# EAGLE design PointController (EAGLE 6.1)
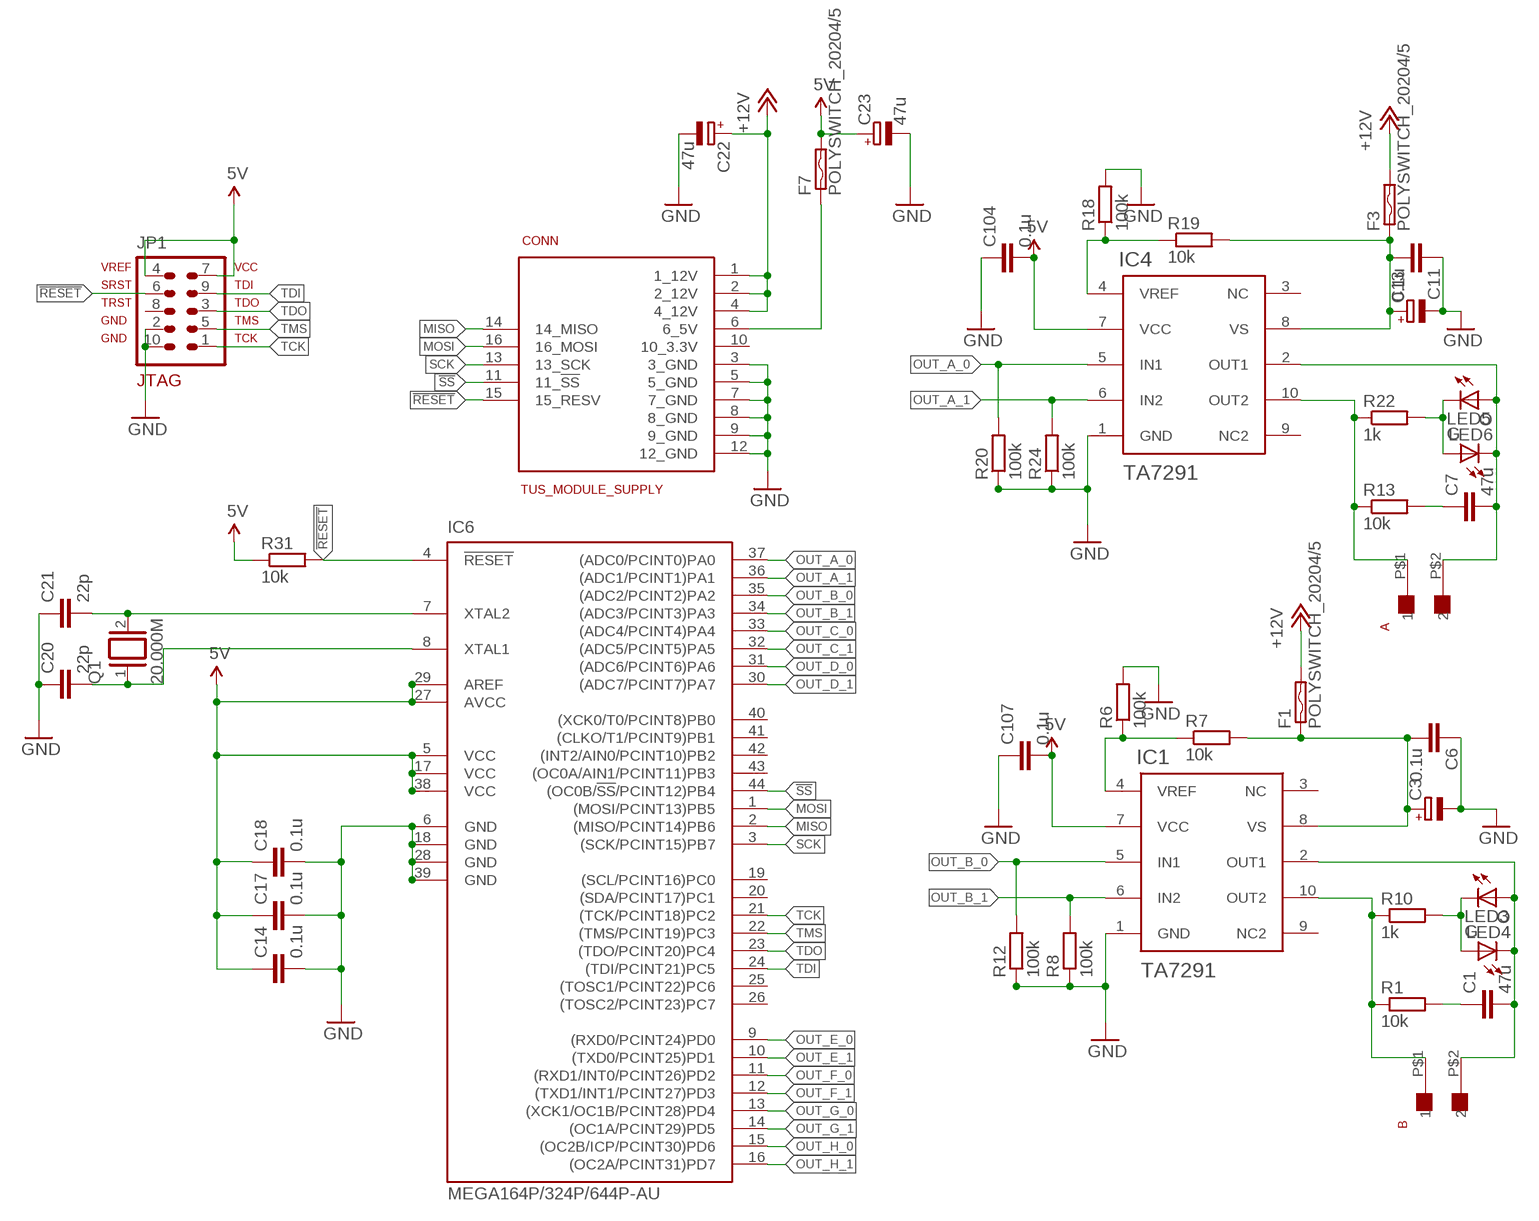
[diagram p0: schematic, sheet 1, part 1 of 2]
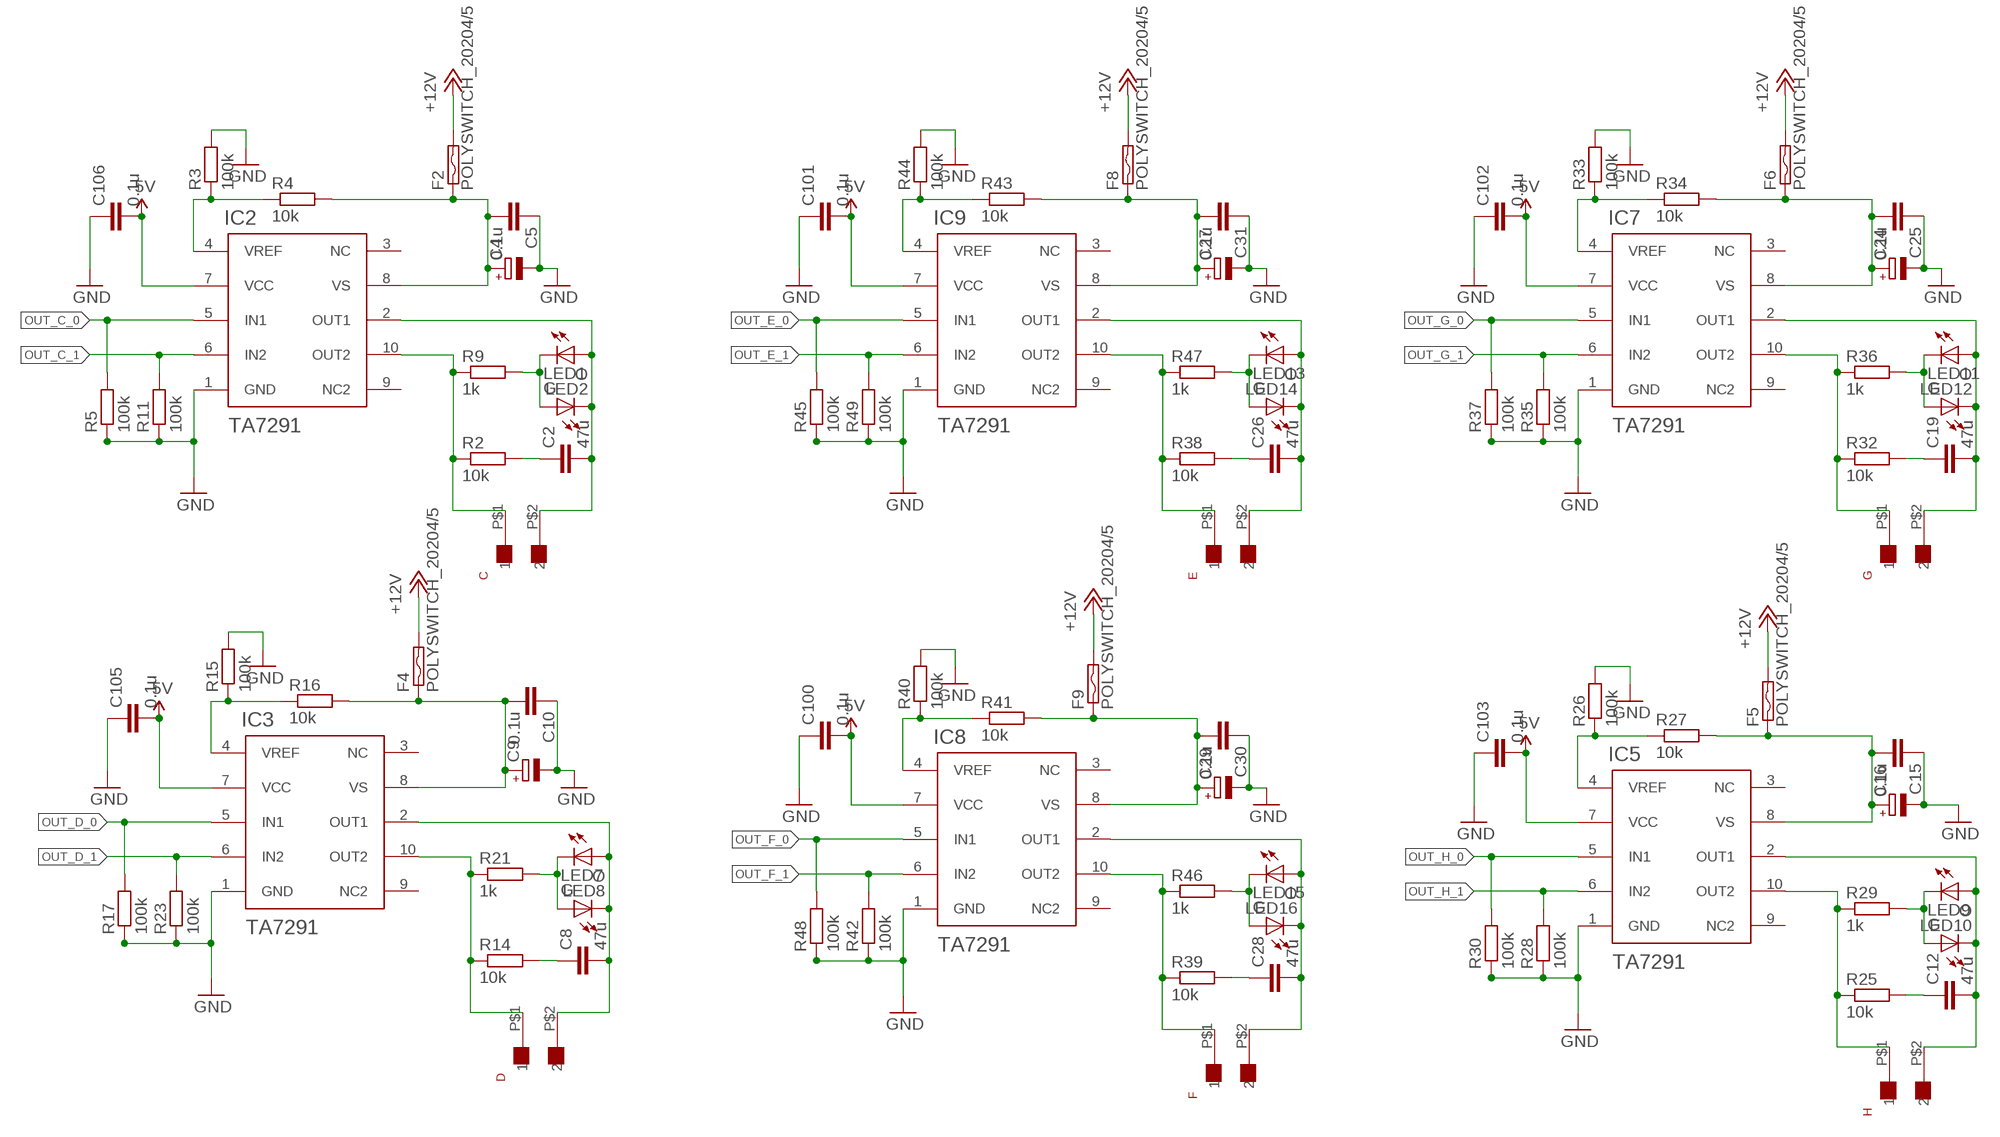
[diagram p1: schematic, sheet 1, part 2 of 2]

## Parts
A  XH-2  [XH-2]
B  XH-2  [XH-2]
C  XH-2  [XH-2]
C1  47u  C5/3  [C5B3]
C2  47u  C5/3  [C5B3]
C3  CPOL-EUE2.5-5  [E2,5-5]
C4  CPOL-EUE2.5-5  [E2,5-5]
C5  0.1u  C-EUC1608  [C1608]
C6  0.1u  C-EUC1608  [C1608]
C7  47u  C5/3  [C5B3]
C8  47u  C5/3  [C5B3]
C9  CPOL-EUE2.5-5  [E2,5-5]
C10  0.1u  C-EUC1608  [C1608]
C11  0.1u  C-EUC1608  [C1608]
C12  47u  C5/3  [C5B3]
C13  CPOL-EUE2.5-5  [E2,5-5]
C14  0.1u  C-EUC1608  [C1608]
C15  0.1u  C-EUC1608  [C1608]
C16  CPOL-EUE2.5-5  [E2,5-5]
C17  0.1u  C-EUC1608  [C1608]
C18  0.1u  C-EUC1608  [C1608]
C19  47u  C5/3  [C5B3]
C20  22p  C-EUC1608  [C1608]
C21  22p  C-EUC1608  [C1608]
C22  47u  CPOL-EUE2.5-5  [E2,5-5]
C23  47u  CPOL-EUE2.5-5  [E2,5-5]
C24  CPOL-EUE2.5-5  [E2,5-5]
C25  0.1u  C-EUC1608  [C1608]
C26  47u  C5/3  [C5B3]
C27  CPOL-EUE2.5-5  [E2,5-5]
C28  47u  C5/3  [C5B3]
C29  CPOL-EUE2.5-5  [E2,5-5]
C30  0.1u  C-EUC1608  [C1608]
C31  0.1u  C-EUC1608  [C1608]
C100  0.1u  C-EUC1608  [C1608]
C101  0.1u  C-EUC1608  [C1608]
C102  0.1u  C-EUC1608  [C1608]
C103  0.1u  C-EUC1608  [C1608]
C104  0.1u  C-EUC1608  [C1608]
C105  0.1u  C-EUC1608  [C1608]
C106  0.1u  C-EUC1608  [C1608]
C107  0.1u  C-EUC1608  [C1608]
CONN  TUS_MODULE_SUPPLY  [2X08]
D  XH-2  [XH-2]
E  XH-2  [XH-2]
F  XH-2  [XH-2]
F1  POLYSWITCH_20204/5  [0204/5]
F2  POLYSWITCH_20204/5  [0204/5]
F3  POLYSWITCH_20204/5  [0204/5]
F4  POLYSWITCH_20204/5  [0204/5]
F5  POLYSWITCH_20204/5  [0204/5]
F6  POLYSWITCH_20204/5  [0204/5]
F7  POLYSWITCH_20204/5  [0204/5]
F8  POLYSWITCH_20204/5  [0204/5]
F9  POLYSWITCH_20204/5  [0204/5]
G  XH-2  [XH-2]
H  XH-2  [XH-2]
IC1  TA7291  [HSIP10]
IC2  TA7291  [HSIP10]
IC3  TA7291  [HSIP10]
IC4  TA7291  [HSIP10]
IC5  TA7291  [HSIP10]
IC6  MEGA164P/324P/644P-AU  [TQFP44]
IC7  TA7291  [HSIP10]
IC8  TA7291  [HSIP10]
IC9  TA7291  [HSIP10]
JP1  AVR-JTAG-10  [AVR-JTAG-10]
LED1  G  LED3MM  [LED3MM]
LED2  O  LED3MM  [LED3MM]
LED3  G  LED3MM  [LED3MM]
LED4  O  LED3MM  [LED3MM]
LED5  G  LED3MM  [LED3MM]
LED6  O  LED3MM  [LED3MM]
LED7  G  LED3MM  [LED3MM]
LED8  O  LED3MM  [LED3MM]
LED9  G  LED3MM  [LED3MM]
LED10  O  LED3MM  [LED3MM]
LED11  G  LED3MM  [LED3MM]
LED12  O  LED3MM  [LED3MM]
LED13  G  LED3MM  [LED3MM]
LED14  O  LED3MM  [LED3MM]
LED15  G  LED3MM  [LED3MM]
LED16  O  LED3MM  [LED3MM]
Q1  20.000M  XTAL/S  [QS]
R1  10k  R-EU_0204/7  [0204/7]
R2  10k  R-EU_0204/7  [0204/7]
R3  100k  R-EU_R0603  [R0603]
R4  10k  R-EU_R0603  [R0603]
R5  100k  R-EU_R0603  [R0603]
R6  100k  R-EU_R0603  [R0603]
R7  10k  R-EU_R0603  [R0603]
R8  100k  R-EU_R0603  [R0603]
R9  1k  R-EU_R0603  [R0603]
R10  1k  R-EU_R0603  [R0603]
R11  100k  R-EU_R0603  [R0603]
R12  100k  R-EU_R0603  [R0603]
R13  10k  R-EU_0204/7  [0204/7]
R14  10k  R-EU_0204/7  [0204/7]
R15  100k  R-EU_R0603  [R0603]
R16  10k  R-EU_R0603  [R0603]
R17  100k  R-EU_R0603  [R0603]
R18  100k  R-EU_R0603  [R0603]
R19  10k  R-EU_R0603  [R0603]
R20  100k  R-EU_R0603  [R0603]
R21  1k  R-EU_R0603  [R0603]
R22  1k  R-EU_R0603  [R0603]
R23  100k  R-EU_R0603  [R0603]
R24  100k  R-EU_R0603  [R0603]
R25  10k  R-EU_0204/7  [0204/7]
R26  100k  R-EU_R0603  [R0603]
R27  10k  R-EU_R0603  [R0603]
R28  100k  R-EU_R0603  [R0603]
R29  1k  R-EU_R0603  [R0603]
R30  100k  R-EU_R0603  [R0603]
R31  10k  R-EU_R0603  [R0603]
R32  10k  R-EU_0204/7  [0204/7]
R33  100k  R-EU_R0603  [R0603]
R34  10k  R-EU_R0603  [R0603]
R35  100k  R-EU_R0603  [R0603]
R36  1k  R-EU_R0603  [R0603]
R37  100k  R-EU_R0603  [R0603]
R38  10k  R-EU_0204/7  [0204/7]
R39  10k  R-EU_0204/7  [0204/7]
R40  100k  R-EU_R0603  [R0603]
R41  10k  R-EU_R0603  [R0603]
R42  100k  R-EU_R0603  [R0603]
R43  10k  R-EU_R0603  [R0603]
R44  100k  R-EU_R0603  [R0603]
R45  100k  R-EU_R0603  [R0603]
R46  1k  R-EU_R0603  [R0603]
R47  1k  R-EU_R0603  [R0603]
R48  100k  R-EU_R0603  [R0603]
R49  100k  R-EU_R0603  [R0603]

## Nets
5V [5v]: C14.1 C17.1 C18.1 C23.+ C100.2 C101.2 C102.2 C103.2 C104.2 C105.2 C106.2 C107.2 F7.2 IC1.7(VCC) IC2.7(VCC) IC3.7(VCC) IC4.7(VCC) IC5.7(VCC) IC6.5(VCC) IC6.17(VCC) IC6.27(AVCC) IC6.29(AREF) IC6.38(VCC) IC7.7(VCC) IC8.7(VCC) IC9.7(VCC) JP1.4 JP1.7 R31.1
!RESET: CONN.15(15_RESV) IC6.4(!RESET) JP1.6 R31.2
!SS: CONN.11(11_!SS) IC6.44((OC0B/!SS!/PCINT12)PB4)
+12V [12v]: C22.+ CONN.1(1_12V) CONN.2(2_12V) CONN.4(4_12V) F1.2 F2.2 F3.2 F4.2 F5.2 F6.2 F8.2 F9.2
GND: C3.- C4.- C5.1 C6.1 C9.- C10.1 C11.1 C13.- C14.2 C15.1 C16.- C17.2 C18.2 C20.1 C21.1 C22.- C23.- C24.- C25.1 C27.- C29.- C30.1 C31.1 C100.1 C101.1 C102.1 C103.1 C104.1 C105.1 C106.1 C107.1 CONN.3(3_GND) CONN.5(5_GND) CONN.7(7_GND) CONN.8(8_GND) CONN.9(9_GND) CONN.12(12_GND) IC1.1(GND) IC2.1(GND) IC3.1(GND) IC4.1(GND) IC5.1(GND) IC6.6(GND) IC6.18(GND) IC6.28(GND) IC6.39(GND) IC7.1(GND) IC8.1(GND) IC9.1(GND) JP1.2 JP1.10 R3.2 R5.1 R6.2 R8.1 R11.1 R12.1 R15.2 R17.1 R18.2 R20.1 R23.1 R24.1 R26.2 R28.1 R30.1 R33.2 R35.1 R37.1 R40.2 R42.1 R44.2 R45.1 R48.1 R49.1
MISO: CONN.14(14_MISO) IC6.2((MISO/PCINT14)PB6)
MOSI: CONN.16(16_MOSI) IC6.1((MOSI/PCINT13)PB5)
N$1: LED5.K(C) LED6.A R22.2
N$2: IC1.4(VREF) R6.1 R7.1
N$3: C20.2 IC6.8(XTAL1) Q1.1
N$4: C21.2 IC6.7(XTAL2) Q1.2
N$5 [out]: B.P$2 C1.2 IC1.2(OUT1) LED3.A LED4.K(C)
N$6: IC4.4(VREF) R18.1 R19.1
N$7 [out]: A.P$2 C7.2 IC4.2(OUT1) LED5.A LED6.K(C)
N$8 [out]: A.P$1 IC4.10(OUT2) R13.1 R22.1
N$9 [out]: C7.1 R13.2
N$10 [out]: B.P$1 IC1.10(OUT2) R1.1 R10.1
N$11 [out]: C1.1 R1.2
N$12: LED3.K(C) LED4.A R10.2
N$13: IC2.4(VREF) R3.1 R4.1
N$14 [out]: C2.2 C.P$2 IC2.2(OUT1) LED1.A LED2.K(C)
N$15 [out]: C.P$1 IC2.10(OUT2) R2.1 R9.1
N$16 [out]: C2.1 R2.2
N$17: LED1.K(C) LED2.A R9.2
N$18: IC3.4(VREF) R15.1 R16.1
N$19 [out]: C8.2 D.P$2 IC3.2(OUT1) LED7.A LED8.K(C)
N$20 [out]: D.P$1 IC3.10(OUT2) R14.1 R21.1
N$21 [out]: C8.1 R14.2
N$22: LED7.K(C) LED8.A R21.2
N$23: IC9.4(VREF) R43.1 R44.1
N$24 [out]: C26.2 E.P$2 IC9.2(OUT1) LED13.A LED14.K(C)
N$25 [out]: E.P$1 IC9.10(OUT2) R38.1 R47.1
N$26 [out]: C26.1 R38.2
N$27: LED13.K(C) LED14.A R47.2
N$28: IC8.4(VREF) R40.1 R41.1
N$29 [out]: C28.2 F.P$2 IC8.2(OUT1) LED15.A LED16.K(C)
N$30 [out]: F.P$1 IC8.10(OUT2) R39.1 R46.1
N$31 [out]: C28.1 R39.2
N$32: LED15.K(C) LED16.A R46.2
N$33: IC7.4(VREF) R33.1 R34.1
N$34 [out]: C19.2 G.P$2 IC7.2(OUT1) LED11.A LED12.K(C)
N$35 [out]: G.P$1 IC7.10(OUT2) R32.1 R36.1
N$36 [out]: C19.1 R32.2
N$37: LED11.K(C) LED12.A R36.2
N$38: IC5.4(VREF) R26.1 R27.1
N$39 [out]: C12.2 H.P$2 IC5.2(OUT1) LED9.A LED10.K(C)
N$40 [out]: H.P$1 IC5.10(OUT2) R25.1 R29.1
N$41 [out]: C12.1 R25.2
N$42: LED9.K(C) LED10.A R29.2
N$44 [5v]: CONN.6(6_5V) F7.1
N$45 [12v]: C11.2 C13.+ F3.1 IC4.8(VS) R19.2
N$46 [12v]: C4.+ C5.2 F2.1 IC2.8(VS) R4.2
N$47 [12v]: C27.+ C31.2 F8.1 IC9.8(VS) R43.2
N$48 [12v]: C24.+ C25.2 F6.1 IC7.8(VS) R34.2
N$49 [12v]: C15.2 C16.+ F5.1 IC5.8(VS) R27.2
N$50 [12v]: C29.+ C30.2 F9.1 IC8.8(VS) R41.2
N$51 [12v]: C9.+ C10.2 F4.1 IC3.8(VS) R16.2
N$52 [12v]: C3.+ C6.2 F1.1 IC1.8(VS) R7.2
OUT_A_0: IC4.5(IN1) IC6.37((ADC0/PCINT0)PA0) R20.2
OUT_A_1: IC4.6(IN2) IC6.36((ADC1/PCINT1)PA1) R24.2
OUT_B_0: IC1.5(IN1) IC6.35((ADC2/PCINT2)PA2) R12.2
OUT_B_1: IC1.6(IN2) IC6.34((ADC3/PCINT3)PA3) R8.2
OUT_C_0: IC2.5(IN1) IC6.33((ADC4/PCINT4)PA4) R5.2
OUT_C_1: IC2.6(IN2) IC6.32((ADC5/PCINT5)PA5) R11.2
OUT_D_0: IC3.5(IN1) IC6.31((ADC6/PCINT6)PA6) R17.2
OUT_D_1: IC3.6(IN2) IC6.30((ADC7/PCINT7)PA7) R23.2
OUT_E_0: IC6.9((RXD0/PCINT24)PD0) IC9.5(IN1) R45.2
OUT_E_1: IC6.10((TXD0/PCINT25)PD1) IC9.6(IN2) R49.2
OUT_F_0: IC6.11((RXD1/INT0/PCINT26)PD2) IC8.5(IN1) R48.2
OUT_F_1: IC6.12((TXD1/INT1/PCINT27)PD3) IC8.6(IN2) R42.2
OUT_G_0: IC6.13((XCK1/OC1B/PCINT28)PD4) IC7.5(IN1) R37.2
OUT_G_1: IC6.14((OC1A/PCINT29)PD5) IC7.6(IN2) R35.2
OUT_H_0: IC5.5(IN1) IC6.15((OC2B/ICP/PCINT30)PD6) R30.2
OUT_H_1: IC5.6(IN2) IC6.16((OC2A/PCINT31)PD7) R28.2
SCK: CONN.13(13_SCK) IC6.3((SCK/PCINT15)PB7)
TCK: IC6.21((TCK/PCINT18)PC2) JP1.1
TDI: IC6.24((TDI/PCINT21)PC5) JP1.9
TDO: IC6.23((TDO/PCINT20)PC4) JP1.3
TMS: IC6.22((TMS/PCINT19)PC3) JP1.5
Unconnected: CONN.10(10_3.3V) IC1.3(NC) IC1.9(NC2) IC2.3(NC) IC2.9(NC2) IC3.3(NC) IC3.9(NC2) IC4.3(NC) IC4.9(NC2) IC5.3(NC) IC5.9(NC2) IC6.19((SCL/PCINT16)PC0) IC6.20((SDA/PCINT17)PC1) IC6.25((TOSC1/PCINT22)PC6) IC6.26((TOSC2/PCINT23)PC7) IC6.40((XCK0/T0/PCINT8)PB0) IC6.41((CLKO/T1/PCINT9)PB1) IC6.42((INT2/AIN0/PCINT10)PB2) IC6.43((OC0A/AIN1/PCINT11)PB3) IC7.3(NC) IC7.9(NC2) IC8.3(NC) IC8.9(NC2) IC9.3(NC) IC9.9(NC2) JP1.8

## Library data of the parts
A B C D E F G H = myparts:XH-2
C1 C2 C7 C8 C12 C19 C26 C28 = capacitor-wima:C: CAPACITOR naming: grid - package width
C3 C4 C9 C13 C16 C22-C24 C27 C29 = rcl:CPOL-EU: POLARIZED CAPACITOR, European symbol
C5 C6 C10 C11 C14 C15 C17 C18 C20 C21 C25 C30 C31 C100-C107 = rcl:C-EU: CAPACITOR, European symbol
CONN = myparts:TUS_MODULE_SUPPLY
F1-F9 = myparts:POLYSWITCH_2
IC1-IC5 IC7-IC9 = TA7291P:TA7291
IC6 = avr-7:MEGA164P/324P/644P-AU
JP1 = avr-7:AVR-JTAG-10: AVR JTAG Debug/Programming Header
LED1-LED16 = led:LED: LED OSRAM: - CHIPLED LG R971, LG N971, LY N971, LG Q971, LY Q971, LO R971, LY R971 LH N974, LH R974 LS Q976, LO Q976, LY Q976 LO Q996 - Hyper CHIPLED LW Q18S LB Q993, LB Q99A, LB R99A - SideLED LS A670, LO A670, LY A670, LG A670, LP A670 LB A673, LV A673, LT A673, LW A673 LH A674 LY A675 LS A676, LA A676, LO A676, LY A676, LW A676 LS A679, LY A679, LG A679 - Hyper Micro SIDELED® LS Y876, LA Y876, LO Y876, LY Y876 LT Y87S - SmartLED LW L88C, LW L88S LB L89C, LB L89S, LG L890 LS L89K, LO L89K, LY L89K LS L896, LA L896, LO L896, LY L896 - TOPLED LS T670, LO T670, LY T670, LG T670, LP T670 LSG T670, LSP T670, LSY T670, LOP T670, LYG T670 LG T671, LOG T671, LSG T671 LB T673, LV T673, LT T673, LW T673 LH T674 LS T676, LA T676, LO T676, LY T676, LB T676, LH T676, LSB T676, LW T676 LB T67C, LV T67C, LT T67C, LS T67K, LO T67K, LY T67K, LW E67C LS E67B, LA E67B, LO E67B, LY E67B, LB E67C, LV E67C, LT E67C LW T67C LS T679, LY T679, LG T679 LS T770, LO T770, LY T770, LG T770, LP T770 LB T773, LV T773, LT T773, LW T773 LH T774 LS E675, LA E675, LY E675, LS T675 LS T776, LA T776, LO T776, LY T776, LB T776 LHGB T686 LT T68C, LB T68C - Hyper Mini TOPLED® LB M676 - Mini TOPLED Santana® LG M470 LS M47K, LO M47K, LY M47K Source: http://www.osram.convergy.de LUXEON: - LUMILED® LXK2-PW12-R00, LXK2-PW12-S00, LXK2-PW14-U00, LXK2-PW14-V00 LXK2-PM12-R00, LXK2-PM12-S00, LXK2-PM14-U00 LXK2-PE12-Q00, LXK2-PE12-R00, LXK2-PE12-S00, LXK2-PE14-T00, LXK2-PE14-U00 LXK2-PB12-K00, LXK2-PB12-L00, LXK2-PB12-M00, LXK2-PB14-N00, LXK2-PB14-P00, LXK2-PB14-Q00 LXK2-PR12-L00, LXK2-PR12-M00, LXK2-PR14-Q00, LXK2-PR14-R00 LXK2-PD12-Q00, LXK2-PD12-R00, LXK2-PD12-S00 LXK2-PH12-R00, LXK2-PH12-S00 LXK2-PL12-P00, LXK2-PL12-Q00, LXK2-PL12-R00 Source: www.luxeon.com KINGBRIGHT: KA-3528ASYC Source: www.kingbright.com
Q1 = special:XTAL/S: CRYSTAL
R1 R2 R9 R10 R13 R14 R21 R22 R25 R29 R32 R36 R38 R39 R46 R47 = resistor:R-EU_: RESISTOR, European symbol
R3-R8 R11 R12 R15-R20 R23 R24 R26-R28 R30 R31 R33-R35 R37 R40-R45 R48 R49 = rcl:R-EU_: RESISTOR, European symbol

## Net classes
1 12v: width 0.508 mm, clearance 0.254 mm
2 5v: width 0.254 mm
3 out: width 0.254 mm

## Board
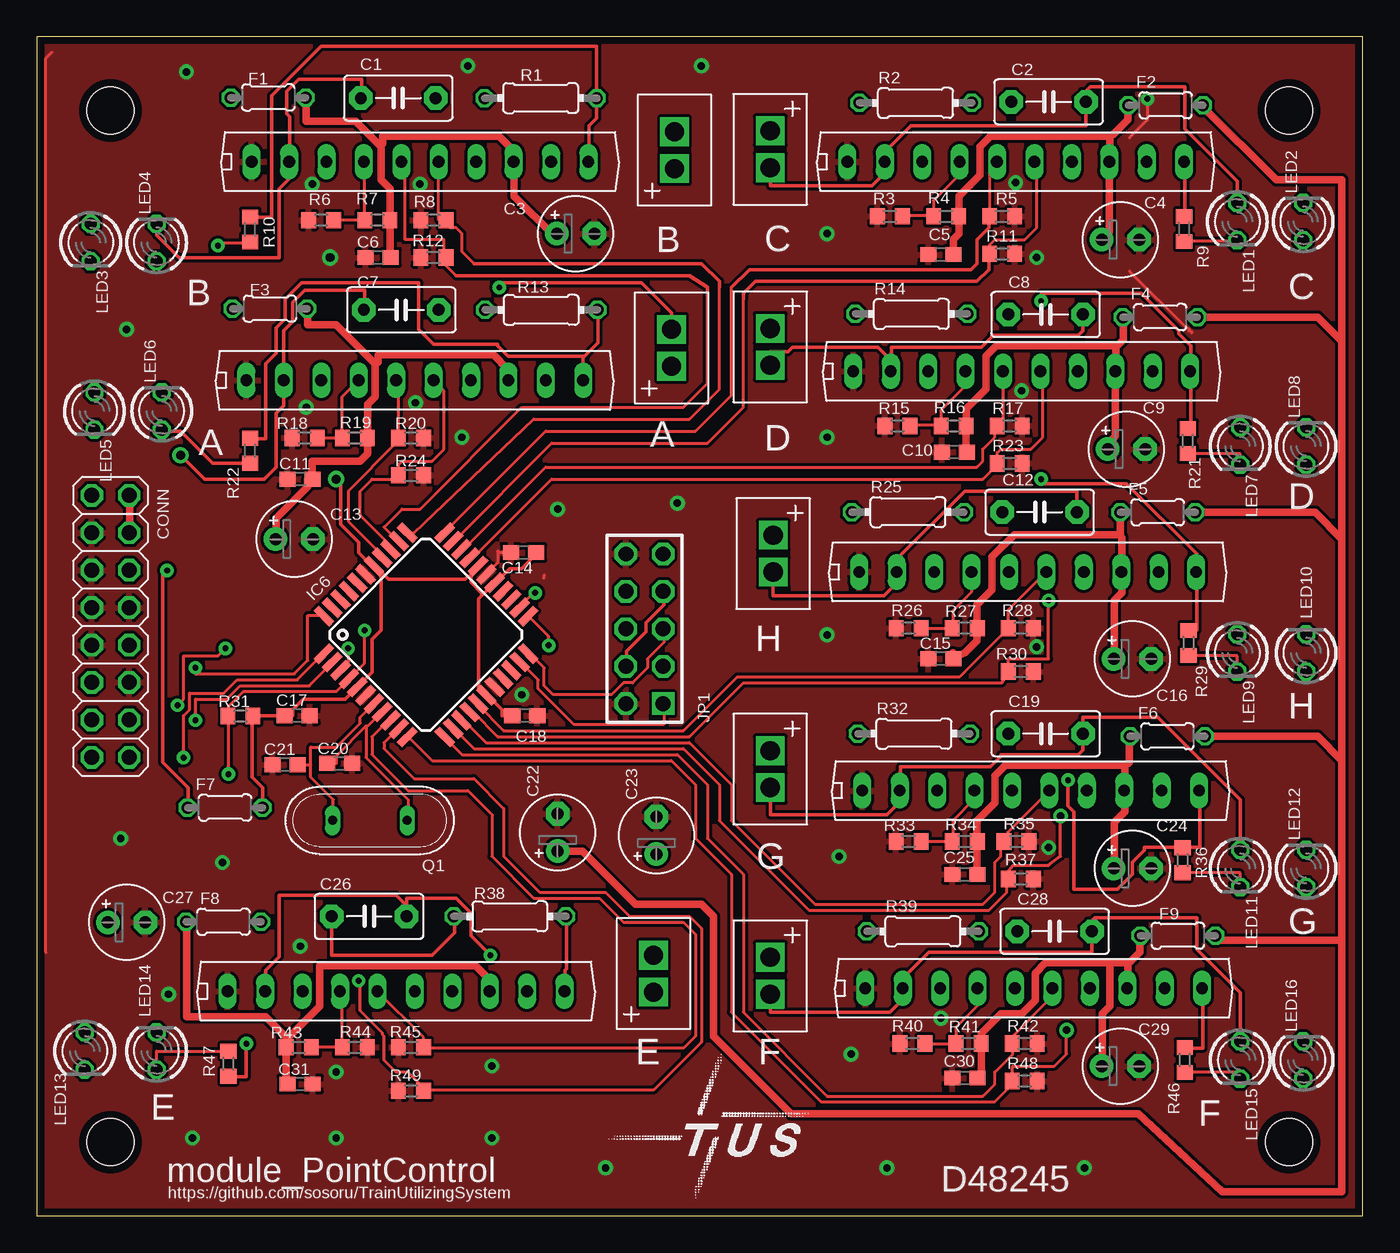
[diagram p2: board, top side]
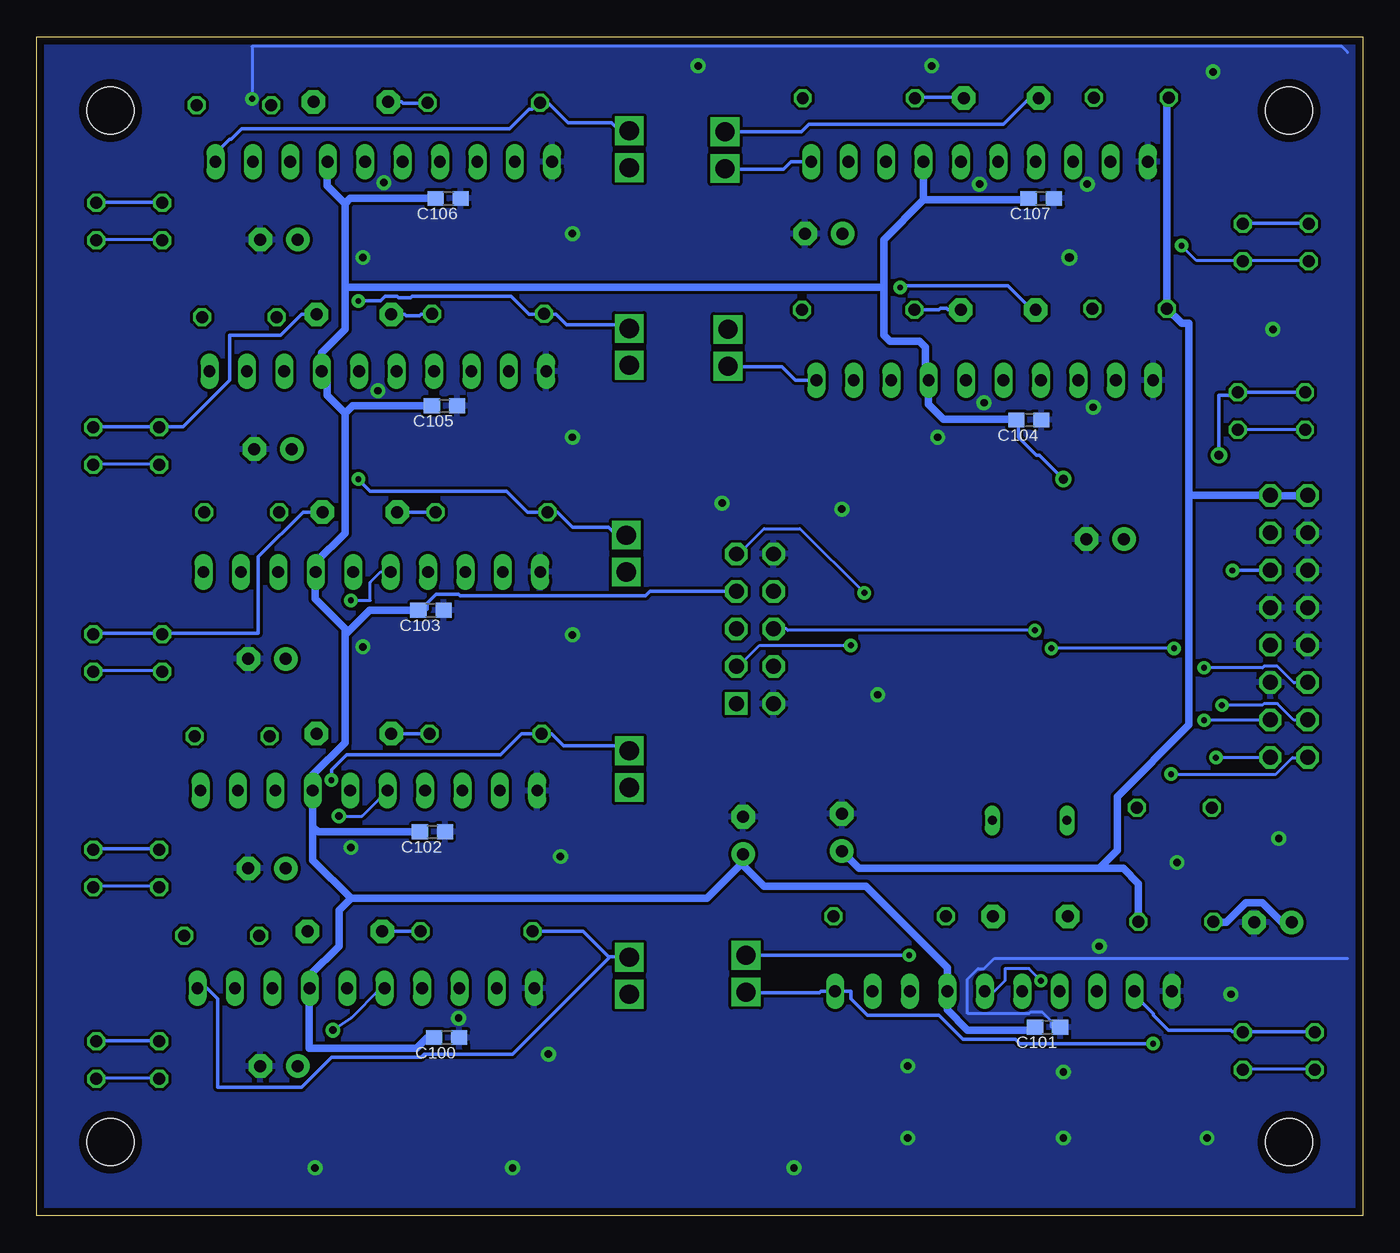
[diagram p3: board, bottom side, seen from below]

Size 90 x 80 mm. Coordinates in mm from the lower left corner, seen from the top.
Outline: 0,0 90,0 90,80 0,80 0,0
Copper layers (1*16): Top 0.035mm / dielectric 1.5mm / Bottom 0.035mm
Design rules: minimum track width 8mil, minimum drill 0.4mm, track to track 8mil, track to pad 8mil, pad to pad 8mil, via to via 8mil, smd to smd 8mil, copper to edge 20mil, drill to drill 8mil, minimum pad ring 8mil, minimum via ring 10mil, stop-mask expansion 3mil, vias tented up to drill 0mil, thermal gap 8mil
Holes 3.2 mm at 5,75 5,5 85,5 85,75
vRestrict: area 51,1.5 to 84.4,17.2

### Footprints (pad centres in the part's own frame; a part is rotated, then mirrored left to right if it is on the bottom)
XH-2 = drill 1.3 square: P$1 -2.5,0; P$2 0,0
C5B3 = drill 0.813 pad 1.6 octagon: 1 -2.54,0; 2 2.54,0
E2,5-5 = drill 0.813 pad 1.6: + -1.27,0 | drill 0.813 pad 1.6 octagon: - 1.27,0
C1608 = smd 1.1 x 1: 1 -0.85,0; 2 0.85,0
2X08 = drill 1.016 octagon: 1 -8.89,-1.27; 2 -8.89,1.27; 3 -6.35,-1.27; 4 -6.35,1.27; 5 -3.81,-1.27; 6 -3.81,1.27; 7 -1.27,-1.27; 8 -1.27,1.27; 9 1.27,-1.27; 10 1.27,1.27; 11 3.81,-1.27; 12 3.81,1.27; 13 6.35,-1.27; 14 6.35,1.27; 15 8.89,-1.27; 16 8.89,1.27
0204/5 = drill 0.813 octagon: 1 -2.54,0; 2 2.54,0
HSIP10 = drill 0.8 long: 1 -11.43,0; 2 -8.89,0; 3 -6.35,0; 4 -3.81,0; 5 -1.27,0; 6 1.27,0; 7 3.81,0; 8 6.35,0; 9 8.89,0; 10 11.43,0
TQFP44 = smd 1.5 x 0.5: 1 -5.8,4; 2 -5.8,3.2; 3 -5.8,2.4; 4 -5.8,1.6; 5 -5.8,0.8; 6 -5.8,0; 7 -5.8,-0.8; 8 -5.8,-1.6; 9 -5.8,-2.4; 10 -5.8,-3.2; 11 -5.8,-4; 23 5.8,-4; 24 5.8,-3.2; 25 5.8,-2.4; 26 5.8,-1.6; 27 5.8,-0.8; 28 5.8,0; 29 5.8,0.8; 30 5.8,1.6; 31 5.8,2.4; 32 5.8,3.2; 33 5.8,4 | smd 0.5 x 1.5: 12 -4,-5.8; 13 -3.2,-5.8; 14 -2.4,-5.8; 15 -1.6,-5.8; 16 -0.8,-5.8; 17 0,-5.8; 18 0.8,-5.8; 19 1.6,-5.8; 20 2.4,-5.8; 21 3.2,-5.8; 22 4,-5.8; 34 4,5.8; 35 3.2,5.8; 36 2.4,5.8; 37 1.6,5.8; 38 0.8,5.8; 39 0,5.8; 40 -0.8,5.8; 41 -1.6,5.8; 42 -2.4,5.8; 43 -3.2,5.8; 44 -4,5.8
AVR-JTAG-10 = drill 1.016 square: 1 -5.08,-1.27 | drill 1.016 octagon: 2 -5.08,1.27; 3 -2.54,-1.27; 4 -2.54,1.27; 5 0,-1.27; 6 0,1.27; 7 2.54,-1.27; 8 2.54,1.27; 9 5.08,-1.27; 10 5.08,1.27
LED3MM = drill 0.813 octagon: A -1.27,0; K 1.27,0
QS = drill 0.61 long: 1 -2.54,0; 2 2.54,0
0204/7 = drill 0.813 octagon: 1 -3.81,0; 2 3.81,0
R0603 = smd 1 x 1.1: 1 -0.85,0; 2 0.85,0

### Placement (x,y rotation side)
A  43.08,60.15 90 top
B  43.28,73.56 90 top
C  49.78,71.12 270 top
C1  24.54,75.84 180 top
C2  68.68,75.59 0 top
C3  36.58,66.65 0 top
C4  73.56,66.24 0 top
C5  61.37,65.23 0 top
C6  23.16,65.02 0 top
C7  24.74,61.47 180 top
C8  68.48,61.16 0 top
C9  73.96,52.02 0 top
C10  62.28,51.82 0 top
C11  17.88,49.99 0 top
C12  68.07,47.75 0 top
C13  17.48,45.92 0 top
C14  33.03,45.01 180 top
C15  61.37,37.8 0 top
C16  74.37,37.8 0 top
C17  17.68,33.93 0 top
C18  33.12,33.93 0 top
C19  68.48,32.72 0 top
C20  20.55,30.71 180 top
C21  16.85,30.61 0 top
C22  35.36,26.01 90 top
C23  42.06,25.81 90 top
C24  74.37,23.57 0 top
C25  62.99,23.16 0 top
C26  22.56,20.32 0 top
C27  6.1,19.91 0 top
C28  69.09,19.3 0 top
C29  73.56,10.16 0 top
C30  62.99,9.35 0 top
C31  17.88,8.94 180 top
C100  62.18,12.09 180 bottom
C101  21.39,12.8 180 bottom
C102  63.14,26.06 180 bottom
C103  63.25,41.1 180 bottom
C104  22.66,54 180 bottom
C105  62.33,54.97 180 bottom
C106  62.08,69.04 180 bottom
C107  21.82,69.04 180 bottom
CONN  5,40 270 top
D  49.78,57.71 270 top
E  41.86,17.68 90 top
F  49.78,15.04 270 top
F1  15.71,75.88 180 top
F2  76.62,75.36 0 top
F3  15.82,61.56 180 top
F4  76.25,60.99 0 top
F5  76.09,47.74 0 top
F6  76.75,32.54 0 top
F7  12.78,27.7 0 top
F8  12.67,19.95 0 top
F9  77.46,19.01 0 top
G  49.78,29.06 270 top
H  49.99,43.69 270 top
IC1  26.01,71.53 0 top
IC2  66.45,71.53 0 top
IC3  66.85,57.3 0 top
IC4  25.65,56.69 0 top
IC5  67.26,43.69 0 top
IC6  26.42,39.42 45 top
IC7  67.46,28.85 0 top
IC8  67.67,15.44 0 top
IC9  24.38,15.24 0 top
JP1  41.25,39.83 90 top
LED1  81.48,67.46 270 top
LED2  85.95,67.46 90 top
LED3  3.66,66.04 270 top
LED4  8.13,66.04 90 top
LED5  3.91,54.61 270 top
LED6  8.48,54.61 90 top
LED7  81.69,52.22 270 top
LED8  86.16,52.22 90 top
LED9  81.48,38.2 270 top
LED10  86.16,38.2 90 top
LED11  81.69,23.57 270 top
LED12  86.16,23.57 90 top
LED13  3.25,11.18 270 top
LED14  8.13,11.18 90 top
LED15  81.69,10.57 270 top
LED16  85.95,10.57 90 top
Q1  22.61,26.84 180 top
R1  34.2,75.84 180 top
R2  59.65,75.51 0 top
R3  57.91,67.82 180 top
R4  61.72,67.82 0 top
R5  65.53,67.82 180 top
R6  19.3,67.56 180 top
R7  23.11,67.56 0 top
R8  26.92,67.56 0 top
R9  77.88,66.95 270 top
R10  14.48,66.93 270 top
R11  65.53,65.28 180 top
R12  26.92,65.02 0 top
R13  34.24,61.47 180 top
R14  59.37,61.2 0 top
R15  58.42,53.59 180 top
R16  62.23,53.59 0 top
R17  66.04,53.59 180 top
R18  18.19,52.78 180 top
R19  21.59,52.78 0 top
R20  25.4,52.78 180 top
R21  78.13,52.58 270 top
R22  14.48,51.92 270 top
R23  66.04,51.05 180 top
R24  25.4,50.24 180 top
R25  59.13,47.75 0 top
R26  59.18,39.88 180 top
R27  62.99,39.88 0 top
R28  66.8,39.88 180 top
R29  78.18,38.86 270 top
R30  66.8,36.93 180 top
R31  13.82,33.91 180 top
R32  59.54,32.72 0 top
R33  59.18,25.4 180 top
R34  62.99,25.4 0 top
R35  66.5,25.4 180 top
R36  77.77,24.13 270 top
R37  66.8,22.86 180 top
R38  32.11,20.32 180 top
R39  60.15,19.3 0 top
R40  59.44,11.68 180 top
R41  63.25,11.68 0 top
R42  67.06,11.68 180 top
R43  17.78,11.43 180 top
R44  21.59,11.43 0 top
R45  25.4,11.43 0 top
R46  77.93,10.57 270 top
R47  13,10.31 90 top
R48  67.06,9.14 180 top
R49  25.4,8.48 0 top

### Tracks (layer width: path | path; a pad name or v marks a point on that pad's centre or on a via)
5V  (via drill 0.6)
  Top 0.254: JP1.4 40.03,37.29 40.03,38.3 41.35,39.62 41.35,40.23 42.57,41.45 42.57,42.37 JP1.7 | F7.2 15.34,27.74 15.34,29.06 14.63,29.77 14.63,33.83 R31.1 14.73,33.93 C17.1 17.37,33.93 17.37,34.34 18.09,35.05 20.93,35.05 21.64,35.76 21.64,35.87 IC6.5 21.84,35.97 22.76,36.88 22.76,39.12 23.37,39.73 23.37,43.59 IC6.38 | IC6.38 22.76,44.09 21.84,45.01 21.84,45.72 20.62,46.94 20.62,49.89 v20.32,49.99 | 29.46,43.38 29.46,42.98 30.23,42.22 | 29.46,43.38 29.46,43.59 29.87,43.99 IC6.29 | 30.23,42.22 30.28,42.16 30.99,42.88 IC6.27 31.17,42.96 32.11,43.89 32.92,43.89 33.73,44.7 33.93,44.7 | 30.23,42.22 30.18,42.16 30.18,42.06 29.97,41.86 29.97,35.76 30.38,35.36 30.48,35.36 IC6.17 30.58,35.36 31.6,34.34 31.6,33.93 C18.1 | 29.46,43.38 29.26,43.38 29.06,43.18 23.88,43.18 22.96,44.09 IC6.38 | 33.93,44.7 34.14,44.7 | 33.93,44.7 33.93,45.01 C14.1
  Bottom 0.254: 71.52,15.24 71.53,15.24 IC8.7 | C104.2 23.37,53.85 23.37,52.83 22.15,51.61 21.95,51.61 v20.32,49.99 | JP1.7 48.36,42.37 48.67,42.06 61.27,42.06 61.37,42.16 62.89,42.16 63.5,41.55 63.5,41.15 63.91,41.15 C103.2
  Bottom 0.508: C23.+ 42.06,23.98 | 42.06,23.98 42.06,23.77 40.64,22.35 33.73,22.35 28.19,16.82 IC9.7 28.19,13.97 26.82,12.6 22.44,12.6 C101.2 | IC8.7 71.48,16.31 69.49,18.29 69.49,20.73 68.68,21.54 | 68.68,21.54 44.5,21.54 42.06,23.98 | 71.27,26.42 IC7.7 71.27,29.92 69.09,32.11 69.09,39.42 | 71.27,26.42 71.27,24.13 68.68,21.54 | 69.09,39.42 69.09,39.83 71.12,41.86 71.12,43.64 IC5.7 71.07,44.35 69.09,46.33 69.09,54.46 | 69.09,62.99 69.09,60.15 70.66,58.57 IC3.7 70.31,56.95 70.31,55.68 69.09,54.46 | 69.09,62.99 69.09,68.68 | 69.09,68.68 70.31,69.9 70.31,71.48 IC2.7 | IC1.7 29.82,68.94 | 29.82,68.94 32.51,66.24 32.51,62.99 | 32.51,62.99 32.51,59.74 32.11,59.33 30.07,59.33 29.67,58.93 29.67,56.9 IC4.7 29.46,55.07 28.45,54.05 23.57,54.05 | 29.82,68.94 22.67,68.94 C107.2 | 23.57,54.05 23.56,54.05 C104.2 23.57,54.05 | C106.2 68.73,69.04 69.09,68.68 | C105.2 68.58,54.97 69.09,54.46 | C103.2 67.41,41.1 69.09,39.42 | C102.2 70.92,26.06 71.27,26.42 | 71.52,15.24 71.53,15.44 71.53,11.38 64.21,11.38 63.5,12.09 C100.2 | 32.51,62.99 69.09,62.99
!RESET  (via drill 0.4)
  Top 0.203: v22.25,39.73 22.25,37.49 21.23,36.47 IC6.4 21.13,36.37 20.32,35.56 14.02,35.56 13.01,34.54 13.01,33.93 R31.2 13.01,33.83 v13.01,29.97
  Bottom 0.203: JP1.6 39.12,39.83 39.01,39.73 v22.25,39.73 | v13.01,29.97 5.89,29.97 4.78,31.09 3.76,31.09 CONN.15
!SS  (via drill 0.4)
  Top 0.203: v10.77,37.19 10.77,36.78 17.48,36.78 18.39,37.69 18.39,40.74 19.41,40.74 IC6.44
  Bottom 0.203: v10.77,37.19 6.81,37.19 6.71,37.29 5.79,37.29 4.67,36.17 3.76,36.17 CONN.11
+12V
  Top 0.508: C22.+ 37.03,24.74 40.64,21.13 45.11,21.13 45.92,20.32 45.92,12.19 51.21,6.91 74.78,6.91 80.47,1.63 88.59,1.63 88.59,18.69 | 88.59,18.69 80.31,18.69 F9.2 | F6.2 86.94,32.54 88.59,30.89 | 88.59,30.89 88.59,18.69 | F5.2 86.78,47.74 88.59,45.92 | 88.59,45.92 88.59,30.89 | F4.2 86.94,60.98 88.59,59.33 | 88.59,59.33 88.59,45.92 | F2.2 79.16,75.27 84.12,70.31 88.59,70.31 88.59,59.33 | CONN.2 6.3,48.87 6.3,46.53 CONN.4
  Bottom 0.508: C22.+ 34.19,23.57 17.88,23.57 | 11.79,48.77 11.79,33.33 16.66,28.45 16.66,24.79 17.88,23.57 | 11.79,48.77 11.79,60.55 12.28,60.55 F3.2 13.28,75.77 F1.2 | CONN.1 3.76,48.87 6.2,48.87 CONN.2 11.66,48.89 11.79,48.77 | F8.2 15.21,22.53 16.26,23.57 17.88,23.57
GND  (via drill 0.4, 0.5, 0.6)
  Top 0.203: 31.09,35.87 IC6.18 31.09,35.87 | 34.44,43.48 34.41,43.29 | 74.17,64.11 78.03,60.25 78.13,60.25 78.23,60.15 78.23,60.05 78.33,60.05 78.4,59.92 | 74.17,73.15 75.39,74.37 v75.39,75.79 | 1.02,78.94 0.61,78.54 0.61,17.88 | 33.93,34.04 C18.2 | C14.2 31.39,45.01 31.29,45.11 31.29,44.3 30.48,43.48 | 31.09,35.87 31.1,35.87
  Bottom 0.203: v75.39,75.79 75.39,79.35 1.42,79.35 1.02,78.94 | 1.02,17.48 24.99,17.48 25.7,16.76 26.11,16.76 26.82,16.05 26.82,13.72 22.66,13.72 22.55,13.82 21.74,13.82 21.13,13.21 21.13,12.8 C101.1
  other vias: 61.37,13.41 68.68,24.99 66.85,55.98 66.45,70.1 67.87,65.02 26.01,70 25.7,55.17 28.85,52.83 32.92,35.36 30.89,10.16 67.87,38.61 19.91,65.02 18.29,54.86 18.69,70 20.32,9.75 8.94,15.04 17.88,18.29 55.27,10.97 71.12,3.25 57.71,3.25 38.61,3.25 20.32,5.28 10.57,5.28 30.89,5.28 5.69,25.6 12.6,23.98 35.36,47.96 54.46,24.38 53.64,39.42 53.64,52.83 53.64,66.65 6.1,60.15 43.48,48.36 45.11,78.03 29.26,78.03 10.16,77.62
  pour Bottom: -1.22,80.87 -1.22,-1.22 91.85,-1.22 91.85,81.28 -1.22,81.28
  pour Top: -2.44,82.5 -2.44,-3.25 93.88,-3.25 93.88,82.91 -2.44,82.91
MISO  (via drill 0.4)
  Top 0.203: v10.77,33.63 10.77,35.05 12.9,35.05 13.82,35.97 18.49,35.97 20.02,37.49 IC6.2
  Bottom 0.203: v10.77,33.63 6.3,33.63 CONN.14
MOSI  (via drill 0.4)
  Top 0.203: v9.96,31.09 9.96,33.93 10.36,34.34 10.36,35.46 12.7,35.46 13.61,36.37 17.68,36.37 19.41,38.1 IC6.1
  Bottom 0.203: v9.96,31.09 6.3,31.09 CONN.16
N$1
  Top 0.203: 8.53,53.24 8.53,53.34 LED6.A
  Top 0.254: R22.2 11.92,51.07 9.75,53.24 8.53,53.24
  Bottom 0.203: LED5.K LED6.A
N$2
  Top 0.203: IC1.4 22.26,71.46 R7.1 R6.1
N$3
  Top 0.203: 22.3,33.17 22.35,33.22 22.45,33.22 23.37,34.14 IC6.8 | 22.3,33.17 20.32,31.19 20.32,30.68 19.71,30.68 C20.2 | Q1.1 25.2,26.92 25.2,28.25 22.35,31.09 22.35,33.12 22.3,33.17
N$4
  Top 0.203: 18.59,30.58 17.78,30.58 C21.2 | 18.59,30.58 18.59,29.77 20.12,28.25 20.12,26.92 Q1.2 | 18.59,30.58 18.59,31.8 20.32,31.8 21.95,33.43 21.95,33.83 22.86,34.75 IC6.7
N$5
  Top 0.254: C1.2 22.05,75.89 22.05,77.11 17.78,77.11 16.97,76.3 16.97,74.78 17.17,74.57 17.17,71.53 IC1.2 17.17,71.42 17.17,70.41 16.46,69.7 16.46,65.02 9.65,65.02 8.13,66.55 LED4.K
  Bottom 0.254: B.P$2 38.1,73.56 37.59,74.07 24.38,74.07 22.55,75.89 22.05,75.89 C1.2 | LED3.A 3.66,67.36 8.13,67.36 LED4.K
N$6
  Top 0.203: R18.1 R19.1 20.74,55.59 IC4.4
N$7  (via drill 0.4, 0.6)
  Top 0.254: C7.2 22.25,61.47 22.25,62.79 18.19,62.79 17.37,61.98 17.37,60.66 16.76,60.05 IC4.2 16.76,54.97 16.26,54.46 16.26,50.8 15.44,49.99 11.38,49.99 v9.75,51.61 | A.P$2 43.08,61.27 41.05,63.3 31.39,63.3 v31.39,62.99
  Bottom 0.254: v31.39,62.99 31.29,63.09 24.08,63.09 22.45,61.47 C7.2 | LED5.A LED6.K 8.53,55.78 8.53,55.68 9.75,55.68 v9.75,51.61
N$8
  Top 0.254: 37.08,58.32 32,58.32 31.29,59.03 31.29,59.13 26.92,59.13 25.91,60.15 25.91,63.3 17.98,63.3 16.87,62.18 16.87,60.86 16.26,60.25 16.26,58.52 15.54,57.81 15.54,52.73 14.53,52.73 R22.1 | IC4.10 37.08,58.32 | R13.1 38.1,61.47 38.1,59.23 37.19,58.32 37.08,58.32
  Bottom 0.254: IC4.10 38.51,56.69 39.42,57.61 43.08,57.61 A.P$1
N$9
  Bottom 0.254: R13.2 28.75,61.47 28.65,61.57 28.25,61.57 28.14,61.47 C7.1
N$10
  Top 0.254: R10.1 14.53,67.77 15.95,67.77 15.95,76 19.3,79.35 38,79.35 38,75.89 R1.1 38,75.79 38,74.47 37.49,73.97 37.49,71.53 IC1.10
  Bottom 0.254: IC1.10 38.81,71.53 39.32,71.02 43.28,71.02 B.P$1
N$11
  Bottom 0.254: R1.2 30.38,75.89 27.13,75.89 C1.1
N$12  (via drill 0.4)
  Top 0.203: v12.29,65.84 12.29,66.04 14.43,66.04 R10.2
  Bottom 0.203: 8.13,64.82 3.66,64.82 LED3.K | v12.29,65.84 11.28,64.82 8.13,64.82 | 8.13,64.82 LED4.A
N$13
  Top 0.203: 60.86,67.97 60.76,67.87 58.83,67.87 R3.1 | 60.86,67.97 60.96,67.87 R4.1 60.86,67.97 | 60.86,67.97 60.86,68.89 62.69,70.71 62.69,71.53 IC2.4
N$14
  Top 0.254: C.P$2 49.78,69.9 56.69,69.9 57.61,70.81 57.61,71.53 IC2.2 57.61,71.63 57.61,72.24 59.33,73.97 71.22,73.97 C2.2 71.22,76.3 71.53,76.61 77.93,76.61 77.93,73.76 81.48,70.21 LED1.A
  Bottom 0.254: LED1.A 81.48,68.78 85.95,68.78 LED2.K
N$15
  Top 0.254: R9.1 77.93,67.87 77.93,71.53 IC2.10
  Bottom 0.254: C.P$1 49.78,73.66 50.49,73.66 51,74.17 53.95,74.17 55.27,75.49 55.78,75.49 R2.1 55.88,75.49 55.98,75.49 56.39,75.08 56.59,75.08 57.91,73.76 76.1,73.76 76.81,73.05 76.91,73.05 77.52,72.44 77.52,71.63 77.62,71.53 IC2.10
N$16
  Bottom 0.254: C2.1 65.23,75.59 65.13,75.49 63.5,75.49 R2.2
N$17
  Top 0.203: R9.2 77.93,66.14 81.48,66.14 LED1.K
  Bottom 0.203: LED2.A 85.95,66.24 81.48,66.24 LED1.K
N$18
  Top 0.203: 61.37,53.75 61.27,53.65 59.33,53.65 R15.1 | 61.37,53.75 61.47,53.65 R16.1 61.37,53.75 | 61.37,53.75 61.37,54.66 63.09,56.39 63.09,57.3 IC3.4
N$19
  Top 0.254: D.P$2 49.78,58.62 51,58.62 51.31,58.93 57.1,58.93 58.01,58.01 58.01,57.3 IC3.2 58.01,58.12 58.01,58.93 64.11,58.93 64.82,59.64 64.82,59.74 70.71,59.74 71.02,60.05 C8.2
  Bottom 0.254: LED8.K 86.16,53.54 81.69,53.54 LED7.A 81.58,53.54 80.06,53.54 76.91,56.69 76.91,59.74 73.46,59.74 72.03,61.16 C8.2
N$20  (via drill 0.4)
  Top 0.254: R21.1 78.13,53.44 78.33,53.44 78.33,57.3 IC3.10 78.33,57.4 78.33,59.03 77.52,59.84 77.52,60.05 74.98,62.59 68.17,62.59 v68.17,62.08
  Bottom 0.254: D.P$1 49.78,60.25 50.49,60.25 50.7,60.45 54.05,60.45 54.76,61.16 55.47,61.16 R14.1 55.68,61.16 56.59,61.16 57.81,62.38 64.52,62.38 64.62,62.28 65.43,62.28 65.53,62.38 66.34,62.38 66.65,62.08 v68.17,62.08
N$21
  Bottom 0.254: C8.1 65.02,61.16 64.92,61.06 64.01,61.06 63.91,61.16 63.2,61.16 R14.2
N$22
  Top 0.203: LED7.K 81.69,51.71 78.13,51.71 R21.2
  Bottom 0.203: LED8.A 86.16,51 81.69,51 LED7.K
N$23
  Top 0.203: IC9.4 20.74,15.07 R44.1 R43.1
N$24  (via drill 0.4)
  Top 0.254: 25.09,21.03 C26.2 | 25.09,21.03 24.38,21.74 16.46,21.74 16.46,17.58 15.54,16.66 15.54,15.24 IC9.2 | v30.79,17.68 29.46,19 29.46,20.52 28.45,21.54 25.09,21.54 25.09,21.03
  Bottom 0.254: IC9.2 15.14,15.24 15.04,15.14 15.04,14.53 14.22,13.72 14.22,13.61 13.21,12.6 8.94,12.6 8.84,12.5 8.13,12.5 LED14.K 8.03,12.5 3.25,12.5 LED13.A | v30.79,17.68 E.P$2
N$25  (via drill 0.4)
  Top 0.254: R38.1 35.97,20.32 35.97,16.76 35.87,16.66 35.87,15.24 IC9.10 | v14.22,11.68 14.22,9.45 R47.1
  Bottom 0.254: E.P$1 41.86,15.14 36.88,15.14 36.78,15.24 IC9.10 34.75,15.24 34.75,14.73 33.63,13.61 28.75,13.61 27.13,11.99 23.57,11.99 23.27,11.68 v14.22,11.68
N$26
  Top 0.254: C26.1 20.02,17.68 26.82,17.68 28.35,19.2 28.35,20.32 R38.2
N$27
  Top 0.203: LED14.A 8.13,11.18 13.01,11.18 R47.2
  Bottom 0.203: LED14.A 8.13,9.96 3.25,9.96 LED13.K
N$28
  Top 0.203: 62.38,11.68 62.38,12.8 63.91,14.33 63.91,15.44 IC8.4 | R40.1 62.38,11.68 | 62.59,11.79 62.48,11.68 R41.1 62.38,11.68
N$29
  Top 0.254: F.P$2 49.78,13.82 57.91,13.82 58.83,14.73 58.83,15.44 IC8.2 58.83,15.54 58.83,16.15 60.55,17.88 71.63,17.88 C28.2 71.63,20.02 71.83,20.22 78.74,20.22 78.74,18.09 81.69,15.14 LED15.A
  Bottom 0.254: LED15.A 81.69,11.89 85.95,11.89 LED16.K
N$30
  Top 0.254: R46.1 77.93,11.38 79.15,11.38 79.15,15.44 IC8.10
  Bottom 0.254: R39.1 52.93,19.3 51.21,17.58 | 51.21,17.58 49.78,17.58 F.P$1 | IC8.10 78.44,15.44 77.72,14.73 77.72,8.74 72.03,8.74 70,10.77 63.91,10.77 63.7,10.97 57.71,10.97 51.21,17.48 51.21,17.58
N$31
  Bottom 0.254: C28.1 R39.2
N$32
  Top 0.203: LED15.K 81.69,9.75 77.93,9.75 R46.2
  Bottom 0.203: LED16.A 85.95,9.35 81.69,9.35 LED15.K
N$33
  Top 0.203: R33.1 R34.1 62.18,25.44 62.18,26.82 63.65,28.3 IC7.4
N$34
  Top 0.254: G.P$2 49.78,27.23 57.71,27.23 58.62,28.14 58.62,28.85 IC7.2 58.62,28.96 58.62,30.48 64.72,30.48 65.43,31.19 65.43,31.29 70.71,31.29 71.02,31.6 C19.2 71.02,33.83 76.1,33.83 81.69,28.25 LED11.A
  Bottom 0.254: LED11.A 81.69,24.89 86.16,24.89 LED12.K
N$35  (via drill 0.4)
  Top 0.254: IC7.10 78.94,28.85 78.94,24.99 77.83,24.99 R36.1 77.72,24.99 75.18,24.99 75.18,24.79 74.37,23.98 74.37,23.16 73.36,22.15 70.41,22.15 70.41,27.43 70,27.84 v70,29.57
  Bottom 0.254: G.P$1 49.78,31.6 50.49,31.6 50.8,31.9 54.25,31.9 55.07,32.72 R32.1 57.1,32.72 58.52,31.29 68.99,31.29 70,30.28 v70,29.57
N$36
  Bottom 0.254: C19.1 R32.2
N$37
  Top 0.203: LED11.K 81.69,23.27 77.83,23.27 R36.2
  Bottom 0.203: LED12.A 86.16,22.35 81.69,22.35 LED11.K
N$38
  Top 0.203: R26.1 62.08,39.88 | 62.08,39.88 62.13,39.88 62.18,39.83 | IC5.4 63.45,42.32 62.18,41.05 62.18,39.91 R27.1 62.08,39.93 62.08,39.88
N$39
  Top 0.254: H.P$2 49.99,42.06 57.51,42.06 58.42,42.98 58.42,43.69 IC5.2 58.42,43.79 58.42,44.6 62.99,49.17 70.61,49.17 C12.2
  Bottom 0.254: LED10.K 86.16,39.52 81.48,39.52 LED9.A 81.38,39.52 74.98,39.52 74.98,44.7 71.93,47.75 C12.2
N$40  (via drill 0.4)
  Top 0.254: R29.1 78.23,39.73 78.74,39.73 78.74,43.69 IC5.10 78.74,43.79 78.74,44.91 73.97,49.68 68.17,49.68 v68.17,49.99
  Bottom 0.254: H.P$1 49.99,46.23 50.7,46.23 51.21,46.74 53.65,46.74 54.66,47.75 R25.1 56.69,47.75 58.12,49.17 67.36,49.17 v68.17,49.99
N$41
  Bottom 0.254: C12.1 R25.2
N$42
  Top 0.203: LED9.K 81.48,38 78.23,38 R29.2
  Bottom 0.203: LED10.A 86.16,36.98 81.48,36.98 LED9.K
N$44  (via drill 0.4)
  Top 0.254: v8.84,43.79 8.53,43.48 8.53,30.79 10.26,29.06 10.26,27.74 F7.1
  Bottom 0.254: v8.84,43.79 6.3,43.79 CONN.6
N$45
  Top 0.508: 22.96,57.81 22.96,55.58 22.45,55.07 22.45,52.83 R19.2 22.44,51.7 21.95,51.21 18.69,51.21 18.69,49.99 C11.2 18.49,50.09 18.39,49.99 18.39,49.48 16.26,47.35 16.26,45.92 C13.+ | 22.96,57.81 20.32,60.45 18.39,60.45 18.39,61.47 F3.1 | IC4.8 32,57.4 30.99,58.42 23.16,58.42 23.16,57.91 22.96,57.81
N$46
  Top 0.508: 72.85,73.25 64.72,73.25 64.01,72.54 64.01,70.61 62.59,69.19 62.59,67.87 R4.2 62.59,67.8 62.59,66.65 62.22,66.28 C5.2 | 72.85,73.25 72.85,71.53 IC2.8 72.8,66.75 C4.+ | F2.1 74.07,75.29 74.07,74.37 73.05,73.36 72.85,73.25
N$47
  Top 0.508: 16.97,12.09 16.97,11.48 R43.2 16.93,9.45 C31.2 | 16.97,12.09 15.54,13.51 10.16,13.51 10.16,19.91 F8.1 | IC9.8 30.79,15.24 30.79,15.95 29.77,16.97 19.2,16.97 19.2,14.22 17.17,12.19 16.97,12.09
  Bottom 0.508: C27.+ 5.49,19.91 6.81,21.23 7.92,21.23 9.25,19.91 10.06,19.91 F8.1
N$48
  Top 0.508: 63.8,25.4 63.8,26.82 65.02,28.04 65.02,29.87 65.73,30.58 73.86,30.58 | 73.86,30.58 73.86,28.85 IC7.8 73.86,28.65 73.86,27.43 73.15,26.72 73.15,23.57 C24.+ | 63.8,25.4 R34.2 | F6.1 74.17,32.51 74.17,30.79 74.07,30.68 73.86,30.58 | 63.8,25.4 63.8,23.16 C25.2
N$49
  Top 0.508: 63.8,39.93 63.8,41.45 64.82,42.47 64.82,44.7 66.34,46.23 73.56,46.23 | 73.56,46.23 73.56,47.65 F5.1 | 63.8,39.93 R27.2 | 73.56,46.23 73.66,46.02 73.66,43.69 IC5.8 73.66,43.48 73.66,42.27 73.15,41.76 73.15,37.8 C16.+ | 63.8,39.93 63.8,39.01 62.99,38.2 C15.2 62.18,38.2
N$50
  Top 0.508: R41.2 64.11,12.39 65.43,13.72 66.85,13.72 67.77,14.63 67.77,16.46 68.48,17.17 72.85,17.17 | 74.07,17.17 72.85,17.17 | 74.07,17.17 74.07,15.44 IC8.8 | R41.2 | F9.1 74.88,19 74.88,17.88 74.27,17.27 74.07,17.17 | R41.2 64.11,9.62 C30.2 | 72.85,17.17 72.85,14.22 72.34,13.72 72.34,10.16 C29.+
N$51
  Top 0.508: 73.25,59.03 65.13,59.03 64.41,58.32 64.41,56.08 63.09,54.76 63.09,53.65 R16.2 63.08,51.87 C10.2 | 73.25,59.03 73.25,57.3 IC3.8 73.2,52.88 72.49,52.17 | F4.1 73.76,60.96 73.76,59.44 73.46,59.13 73.25,59.03 | 72.49,52.17 72.34,52.02 | C9.+ 72.64,52.02 72.49,52.17
N$52
  Top 0.508: 23.98,67.56 23.98,69.7 23.37,70.31 23.37,72.54 | 23.37,72.54 21.64,74.27 18.29,74.27 18.29,75.79 F1.1 | 23.98,67.56 R7.2 | 32.41,71.53 32.41,72.24 31.39,73.25 23.47,73.25 23.47,72.75 23.37,72.54 | 32.41,71.53 IC1.8 | 32.41,71.53 32.41,69.19 35.1,66.5 | 35.1,66.5 35.36,66.24 | 23.98,67.56 23.98,65.06 C6.2 | C3.+ 35.26,66.65 35.1,66.5
OUT_A_0
  Top 0.203: 23.52,44.76 21.13,47.14 21.13,49.17 24.33,52.38 R20.2 24.55,56.53 IC4.5 | 23.52,44.76 23.57,44.7 | IC6.37 23.47,44.7 23.52,44.76
OUT_A_1
  Top 0.203: IC6.36 24.01,45.48 21.95,47.55 21.95,49.17 22.76,49.99 24.3,49.99 R24.2 24.55,50.97 24.79,51.21 26.82,51.21 27.64,52.02 27.64,55.98 IC4.6
OUT_B_0
  Top 0.203: IC6.35 24.52,45.78 23.57,46.74 24.79,47.95 26.01,47.95 32.92,54.86 43.89,54.86 45.52,56.49 45.52,62.59 | IC1.5 24.99,71.42 24.99,66.24 27.64,66.24 27.64,65.02 R12.2 27.77,64.48 28.45,63.8
  Top 0.254: 28.45,63.8 44.3,63.8 45.52,62.99 45.52,62.59
OUT_B_1
  Top 0.203: IC6.34 25.62,46.35 33.73,54.05 44.3,54.05 46.33,56.08 46.33,62.99 | IC1.6 27.28,67.56 R8.2 27.84,67.56 27.84,67.46 27.64,67.46 28.04,67.06 28.45,67.06 28.85,66.65 28.85,65.43 29.67,64.62
  Top 0.254: 29.67,64.62 45.11,64.62 46.33,63.4 46.33,62.99
OUT_C_0
  Top 0.203: IC6.33 27.69,46.38 34.54,53.24 44.7,53.24 47.14,55.68 47.14,62.99 | R5.2 64.68,71.18 65.02,71.53 IC2.5
  Top 0.254: 47.14,62.99 48.36,64.21 63.4,64.21 63.8,64.62 63.8,66.24 64.62,67.06 64.62,67.75 R5.2
OUT_C_1
  Top 0.203: IC6.32 28.31,45.78 34.95,52.43 45.52,52.43 47.95,54.86 47.95,62.18 | 64.43,65.02 R11.2 | R11.2 64.68,65.9 65.02,66.24 67.06,66.24 67.87,67.06 67.87,71.37 IC2.6 | R11.2 64.62,65.13 64.62,65.02
  Top 0.254: 47.95,62.18 47.95,62.59 48.77,63.4 63.8,63.4 64.62,64.21 64.62,65.02
OUT_D_0
  Top 0.203: IC6.31 28.96,45.22 34.54,50.8 63.8,50.8 64.21,51.21 64.21,52.02 65.02,52.83 65.02,53.43 R17.2 | 65.43,53.65 65.28,53.49 65.23,53.54 R17.2 | IC3.5 65.58,53.99 R17.2
OUT_D_1
  Top 0.203: 29.39,44.83 IC6.30 29.46,44.7 | 65.04,50.8 R23.2 | 29.46,44.7 29.67,44.7 34.95,49.99 64.21,49.99 65.02,50.8 R23.2 | 29.46,44.7 29.26,44.7 | R23.2 65.19,51.78 65.43,52.02 67.46,52.02 68.28,52.83 68.28,57.15 IC3.6
OUT_E_0
  Top 0.203: IC6.9 23.87,33.62 22.76,32.51 22.76,31.29 25.2,28.85 29.26,28.85 30.89,27.23 30.89,24.38 33.73,21.54 38.2,21.54 39.83,19.91 43.89,19.91 44.7,19.1 44.7,12.19 43.89,11.38 26.3,11.38 R45.2 26.25,12.1 IC9.5
OUT_E_1  (via drill 0.4)
  Top 0.203: IC6.10 24.52,33.06 23.57,32.11 23.57,31.7 25.6,29.67 29.67,29.67 31.7,27.64 31.7,24.38 34.14,21.95 38.61,21.95 40.23,20.32 44.3,20.32 45.11,19.51 45.11,11.79 41.86,8.53 26.42,8.53 26.16,8.79 | 26.16,8.79 26.01,8.94 | 26.16,8.79 26.21,8.84 R49.2 26.21,8.94 26.01,8.94 | v21.84,15.95 21.95,15.85 21.95,13.92 23.47,12.39 23.47,12.29 23.57,12.19 23.57,10.57 24.38,9.75 25.2,9.75 26.01,8.94
  Bottom 0.203: 25.6,15.29 IC9.6 24.99,15.24 24.28,15.95 24.28,16.76 22.66,16.76 v21.84,15.95
OUT_F_0  (via drill 0.5)
  Top 0.203: IC6.11 25.22,32.49 26.82,30.89 43.08,30.89 44.7,29.26 44.7,25.6 47.14,23.16 47.14,13.82 53.24,7.72 65.02,7.72 66.19,8.89 | 66,8.94 R48.2 | R48.2 66.21,10.12 66.24,10.16 69.09,10.16 69.9,10.97 v69.9,12.6 | 66.19,8.89 66.24,8.94 | R48.2 66.14,8.94 66.19,8.89
  Bottom 0.203: v69.9,12.6 68.68,13.41 66.65,15.44 IC8.5
OUT_F_1
  Top 0.203: 66.24,11.79 66.19,11.73 66.24,11.68 R42.2 66.24,11.65 66.24,10.97 65.02,9.75 65.02,8.94 64.21,8.13 53.65,8.13 47.95,13.82 47.95,23.16 45.52,25.6 45.52,29.26 43.48,31.29 28.85,31.29 27.74,32.41 | 27.74,32.41 27.64,32.51 | 66.24,11.79 66.24,12.19 68.68,14.63 68.68,15.04 69.04,15.39 | 69.04,15.39 69.09,15.44 | 27.74,32.41 IC6.12 | IC8.6 68.99,15.44 69.04,15.39 | 66.24,11.38 66.24,11.79
OUT_G_0  (via drill 0.5)
  Top 0.203: IC6.13 28.31,33.06 29.67,31.7 43.89,31.7 46.33,29.26 46.33,26.82 52.43,20.73 64.62,20.73 65.84,21.95 65.84,22.35 65.99,22.5 | 65.85,22.76 R37.2 | R37.2 65.85,23.28 66.24,23.77 68.68,23.77 69.49,24.38 v69.49,27.13 | 65.99,22.5 66.24,22.76 | R37.2 65.94,22.76 65.94,22.55 65.99,22.5
  Bottom 0.203: v69.49,27.13 67.92,27.13 IC7.5
OUT_G_1
  Top 0.203: IC6.14 28.96,33.62 30.48,32.11 44.3,32.11 47.14,29.26 47.14,26.82 52.83,21.13 64.21,21.13 65.02,21.95 65.02,23.98 65.43,24.38 65.43,25.18 R35.2 65.95,26.07 IC7.6
OUT_H_0  (via drill 0.4)
  Top 0.203: IC6.15 29.62,34.19 31.29,32.51 44.3,32.51 47.95,36.17 65.5,36.17 R30.2 65.94,37.39 65.94,37.8 68.68,37.8 v68.68,41.76
  Bottom 0.203: IC5.5 66.65,43.69 67.36,42.98 67.36,41.76 v68.68,41.76
OUT_H_1
  Top 0.203: IC6.16 29.95,34.67 31.7,32.92 43.89,32.92 47.55,36.58 62.65,36.58 R28.2 65.95,41.11 IC5.6
SCK  (via drill 0.4)
  Top 0.203: v21.13,38.51 21.13,37.59 20.62,37.08 IC6.3 | v12.8,38.51 12.29,38 9.96,38 9.96,35.05 v9.55,34.65
  Bottom 0.203: v12.8,38.51 v21.13,38.51 | v9.55,34.65 6.81,34.65 6.71,34.75 5.79,34.75 4.67,33.63 3.76,33.63 CONN.13
TCK
  Top 0.203: IC6.21 32.82,37.49 32.92,37.49 34.04,36.37 34.04,35.76 36.47,33.33 42.57,33.33 42.57,34.75 JP1.1
TDI  (via drill 0.4)
  Top 0.203: v33.83,42.27 33.73,42.27 32.82,41.35 IC6.24
  Bottom 0.203: v33.83,42.27 38.2,46.63 40.64,46.63 41.96,45.31 41.96,44.91 JP1.9
TDO  (via drill 0.4)
  Top 0.203: v34.75,38.71 34.75,39.32 33.43,40.64 IC6.23
  Bottom 0.203: v34.75,38.71 40.95,38.71 41.96,37.69 41.96,37.29 JP1.3
TMS
  Top 0.203: IC6.22 33.43,38.1 33.53,38.1 34.44,37.19 34.44,35.97 35.05,35.36 39.01,35.36 39.83,36.17 40.44,36.17 41.45,37.19 41.45,37.8 42.57,38.91 42.57,39.83 JP1.5

### Text on the board
tNames: B | C | A | D | H | G | E | F | module_PointControl | D48245 | https://github.com/sosoru/TrainUtilizingSystem